# Altium project WaterLevelControl-v1.0.PrjPcb
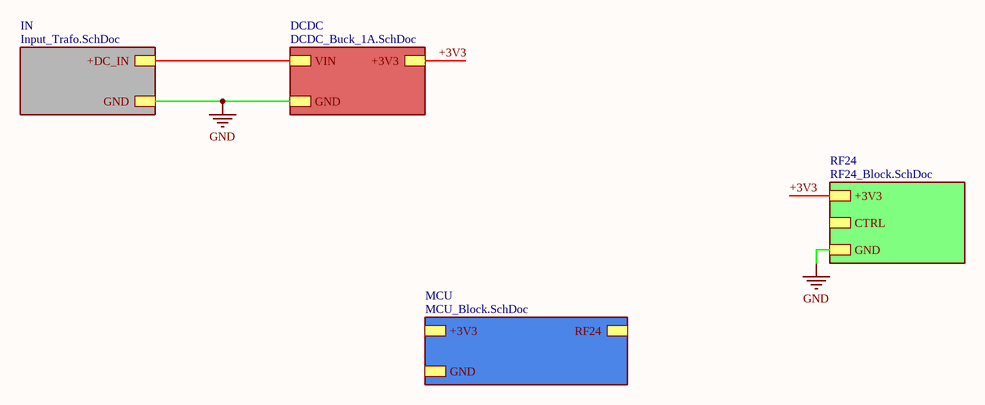
[diagram p0: WaterLevelControl-v1.0_top.SchDoc]
5 sheets, 30 parts. Net scope: hierarchical (ports join the sheet entries above them; power ports are global).
Sheets:
  WaterLevelControl-v1.0_top.SchDoc
    IN = Input_Trafo.SchDoc
    DCDC = DCDC_Buck_1A.SchDoc
    RF24 = RF24_Block.SchDoc
    MCU = MCU_Block.SchDoc

## Sheet WaterLevelControl-v1.0_top.SchDoc
size A4; SheetNumber: 1; SheetTotal: 5

### Sub-sheets
DCDC = DCDC_Buck_1A.SchDoc: GND, VIN, +3V3
IN = Input_Trafo.SchDoc: +DC_IN, GND
MCU = MCU_Block.SchDoc: RF24 (harness RF24), +3V3, GND
RF24 = RF24_Block.SchDoc: +3V3, GND, CTRL (harness RF24)

### Nets
GND: sheet IN/GND, sheet DCDC/GND, sheet RF24/GND, sheet MCU/GND
+3V3: sheet DCDC/+3V3, sheet RF24/+3V3
+DC_IN: sheet IN/+DC_IN, sheet DCDC/VIN

## Sheet Input_Trafo.SchDoc
size A4; SheetNumber: 3; SheetTotal: 3
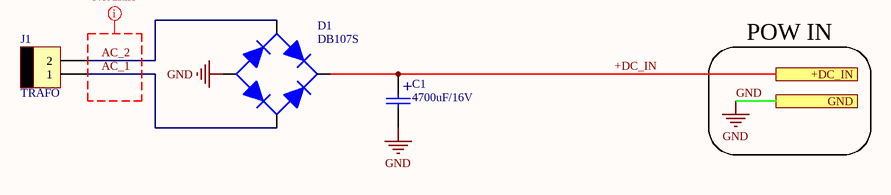
[diagram p1: Input_Trafo.SchDoc]

### Parts
(Parts that share a designator on the sheet are numbered #1, #2 ... from top to bottom, then left to right.)
C1#1  4700uF/16V  [CAP300RP]
D1#1  DB107S  [DBS]
J1  TRAFO  [MOLEX-2]

### Ports
+DC_IN (see WaterLevelControl-v1.0_top[2B]), GND (see WaterLevelControl-v1.0_top[2B], DCDC_Buck_1A[1B])

### Nets
GND: C1#1.2 D1#1.4(-) ; port GND
+DC_IN: C1#1.1 D1#1.2(+) ; port +DC_IN
AC_1: D1#1.3(AC-) J1.1
AC_2: D1#1.1(AC+) J1.2

### Layout directives
net class AC_IN: AC_1, AC_2

### Notes on the sheet
- POW IN
- (in symbol CAPPOL-THT) +

### Library data of the parts
C1#1 = CAPPOL-THT
D1#1 = DB107S: Bridge Rectifier Single Phase Standard 1000 V Surface Mount 4-MiniDIP; JLCPart: C5377
J1 = MOLEX-2

## Sheet DCDC_Buck_1A.SchDoc
size A4; SheetNumber: 2; SheetTotal: 5
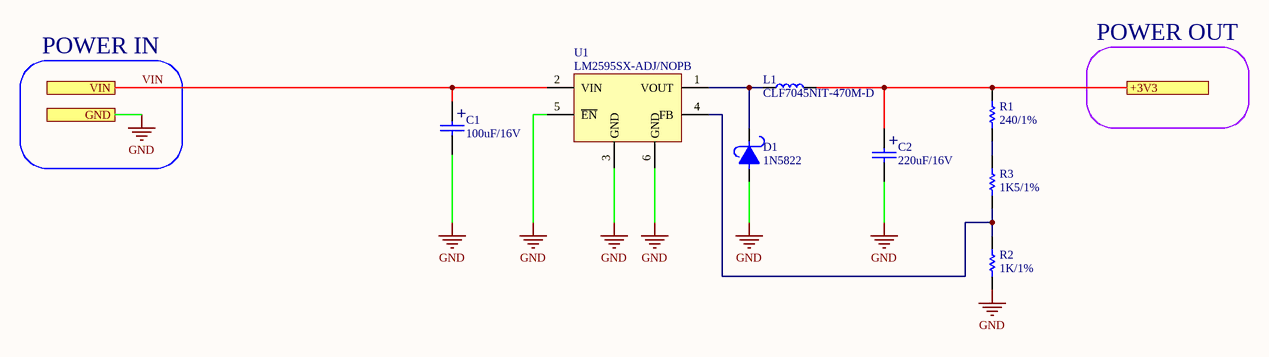
[diagram p2: DCDC_Buck_1A.SchDoc]

### Parts
(Parts that share a designator on the sheet are numbered #1, #2 ... from top to bottom, then left to right.)
C1#2  100uF/16V  [CAP100RP]
C2#1  220uF/16V  [CAP100RP]
D1#2  1N5822  [DO201-AD]
L1  CLF7045NIT-470M-D  [CLF7045NIT-470M-D]
R1  240/1%  [0402-RES-PANASONIC]
R2  1K/1%  [0402-RES-PANASONIC]
R3  1K5/1%  [0402-RES-PANASONIC]
U1#1  LM2595SX-ADJ/NOPB  [TI-TO-263-KTT]

### Ports
+3V3 (see WaterLevelControl-v1.0_top[2B], RF24_Block[1A]), GND (see WaterLevelControl-v1.0_top[2B], Input_Trafo[3B], RF24_Block[1B]), VIN (see WaterLevelControl-v1.0_top[2B])

### Nets
GND: C1#2.2 C2#1.2 D1#2.1 R2.1 U1#1.3(GND) U1#1.5(~{EN}) U1#1.6(GND) ; port GND
+3V3: C2#1.1 L1.2 R1.2 ; port +3V3
VIN: C1#2.1 U1#1.2(VIN) ; port VIN  [project net +DC_IN]
NetD1#2_2: D1#2.2 L1.1 U1#1.1(VOUT)
NetR1_1: R1.1 R3.2
NetR2_2: R2.2 R3.1 U1#1.4(FB)

### Notes on the sheet
- POWER IN
- POWER OUT
- (in symbol CAPPOL-THT) +

### Library data of the parts
C1#2 C2#1 = CAPPOL-THT
D1#2 = DIODE SCHOTTKY: JLCPart: C84619
L1 = CLF7045NIT-470M-D: 47 µH Shielded Drum Core, Wirewound Inductor 1.26 A 160mOhm Max Nonstandard; Digikey_PN: 445-174177-1-ND
R1-R3 = RES-SMD
  R1: JLCPart: C723429
  R2: JLCPart: C11702
  R3: JLCPart: C25867
U1#1 = LM2595SX-ADJ/NOPB: Buck Switching Regulator IC Positive Adjustable 1.2V 1 Output 1A TO-263-6, D2PAK; JLCPart: C181391; Digikey_PN: LM2595SX-ADJ/NOPBCT-ND

## Sheet RF24_Block.SchDoc
size A4; SheetNumber: 5; SheetTotal: 5
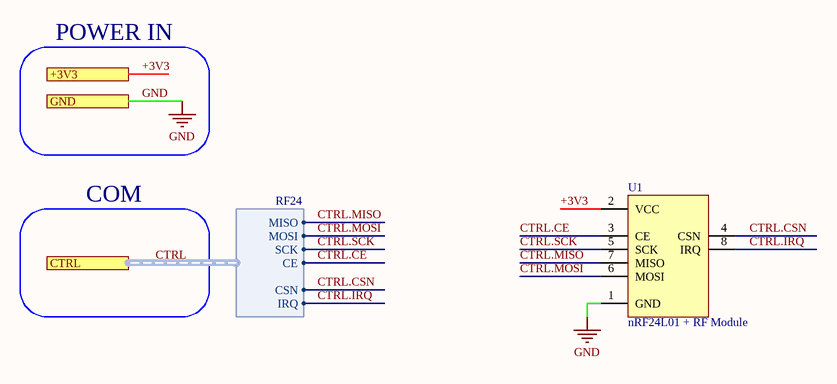
[diagram p3: RF24_Block.SchDoc]

### Parts
(Parts that share a designator on the sheet are numbered #1, #2 ... from top to bottom, then left to right.)
U1#2  nRF24L01 + RF Module  [nRF24L01+Module]

### Ports
+3V3 (see WaterLevelControl-v1.0_top[3C], DCDC_Buck_1A[4B]), CTRL (harness RF24, see WaterLevelControl-v1.0_top[3C]), GND (see WaterLevelControl-v1.0_top[3C], DCDC_Buck_1A[1B], Input_Trafo[3B])

### Harnesses
RF24: CE, MISO, MOSI, SCK, CSN, IRQ

### Nets
GND: U1#2.1(GND) ; port GND
+3V3: U1#2.2(VCC) ; port +3V3
CTRL.CE: U1#2.3(CE) ; port CTRL.CE
CTRL.CSN: U1#2.4(CSN) ; port CTRL.CSN
CTRL.IRQ: U1#2.8(IRQ) ; port CTRL.IRQ
CTRL.MISO: U1#2.7(MISO) ; port CTRL.MISO
CTRL.MOSI: U1#2.6(MOSI) ; port CTRL.MOSI
CTRL.SCK: U1#2.5(SCK) ; port CTRL.SCK

### Buses and harness runs
harness CTRL = port CTRL

### Notes on the sheet
- POWER IN
- COM

## Sheet MCU_Block.SchDoc
size A4; SheetNumber: 4; SheetTotal: 5
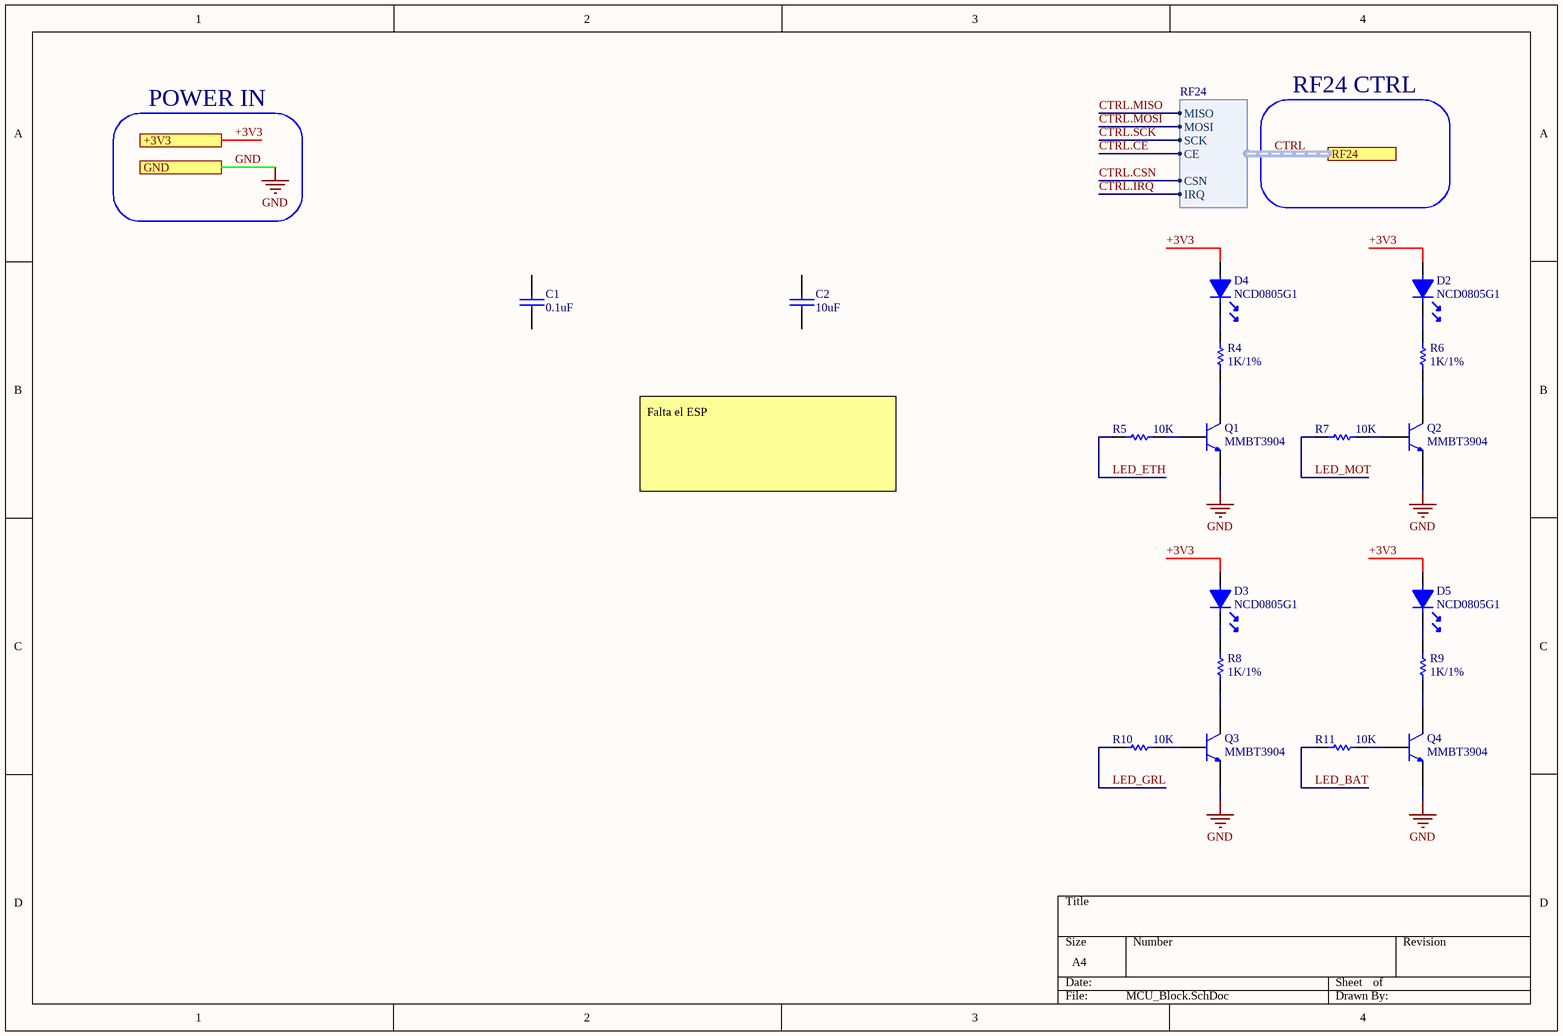
[diagram p4: MCU_Block.SchDoc]

### Parts
(Parts that share a designator on the sheet are numbered #1, #2 ... from top to bottom, then left to right.)
C1#3  0.1uF  [0402-CAP-TDK]
C2#2  10uF  [0603-CAP-TDK]
D2  NCD0805G1  [LED-0805]
D3  NCD0805G1  [LED-0805]
D4  NCD0805G1  [LED-0805]
D5  NCD0805G1  [LED-0805]
Q1  MMBT3904  [VS-SOT-23]
Q2  MMBT3904  [VS-SOT-23]
Q3  MMBT3904  [VS-SOT-23]
Q4  MMBT3904  [VS-SOT-23]
R4  1K/1%  [0402-RES-PANASONIC]
R5  10K  [0402-RES-PANASONIC]
R6  1K/1%  [0402-RES-PANASONIC]
R7  10K  [0402-RES-PANASONIC]
R8  1K/1%  [0402-RES-PANASONIC]
R9  1K/1%  [0402-RES-PANASONIC]
R10  10K  [0402-RES-PANASONIC]
R11  10K  [0402-RES-PANASONIC]

### Ports
+3V3, GND, RF24 (harness RF24)

### Harnesses
RF24: CE, CSN, IRQ, MISO, MOSI, SCK

### Nets
GND: Q1.2(E) Q2.2(E) Q3.2(E) Q4.2(E) ; port GND
+3V3: D2.1 D3.1 D4.1 D5.1 ; port +3V3
CTRL.CE: port RF24.CE
CTRL.CSN: port RF24.CSN
CTRL.IRQ: port RF24.IRQ
CTRL.MISO: port RF24.MISO
CTRL.MOSI: port RF24.MOSI
CTRL.SCK: port RF24.SCK
LED_BAT: R11.2
LED_ETH: R5.2
LED_GRL: R10.2
LED_MOT: R7.2
NetD2_2: D2.2 R6.2
NetD3_2: D3.2 R8.2
NetD4_2: D4.2 R4.2
NetD5_2: D5.2 R9.2
NetQ1_1: Q1.1(B) R5.1
NetQ1_3: Q1.3(C) R4.1
NetQ2_1: Q2.1(B) R7.1
NetQ2_3: Q2.3(C) R6.1
NetQ3_1: Q3.1(B) R10.1
NetQ3_3: Q3.3(C) R8.1
NetQ4_1: Q4.1(B) R11.1
NetQ4_3: Q4.3(C) R9.1

Not connected (* = marked no-connect by the designer): C1#3 1 2; C2#2 1 2

### Buses and harness runs
harness CTRL = port RF24

### Notes on the sheet
- POWER IN
- RF24 CTRL
- Falta el ESP

### Library data of the parts
C1#3 C2#2 = CAP-SMD
  C1#3: JLCPart: C307331
  C2#2: JLCPart: C96446
D2-D5 = NCD0805G1: Green 65mW 0805 Light Emitting Diodes (LED); JLCPart: C84260
Q1-Q4 = MMBT3904: Bipolar (BJT) Transistor NPN 40 V 200 mA 300MHz 350 mW Surface Mount SOT-23; Digikey_PN: 5272-MMBT3904CT-ND; JLCPart: C20526
R4-R11 = RES-SMD
  R4 R6 R8 R9: JLCPart: C11702
  R5 R7 R10 R11: JLCPart: C25744

## Nets that join several sheets
GND: Input_Trafo (C1#1.2 D1#1.4), DCDC_Buck_1A (7 pins), RF24_Block (U1#2.1), MCU_Block (Q1.2 Q2.2 Q3.2 Q4.2)
+3V3: DCDC_Buck_1A (C2#1.1 L1.2 R1.2), RF24_Block (U1#2.2)
+DC_IN: Input_Trafo (C1#1.1 D1#1.2), DCDC_Buck_1A (C1#2.1 U1#1.2)